# Altium project Quail_3.0.PrjPcb (part 1 of 3)
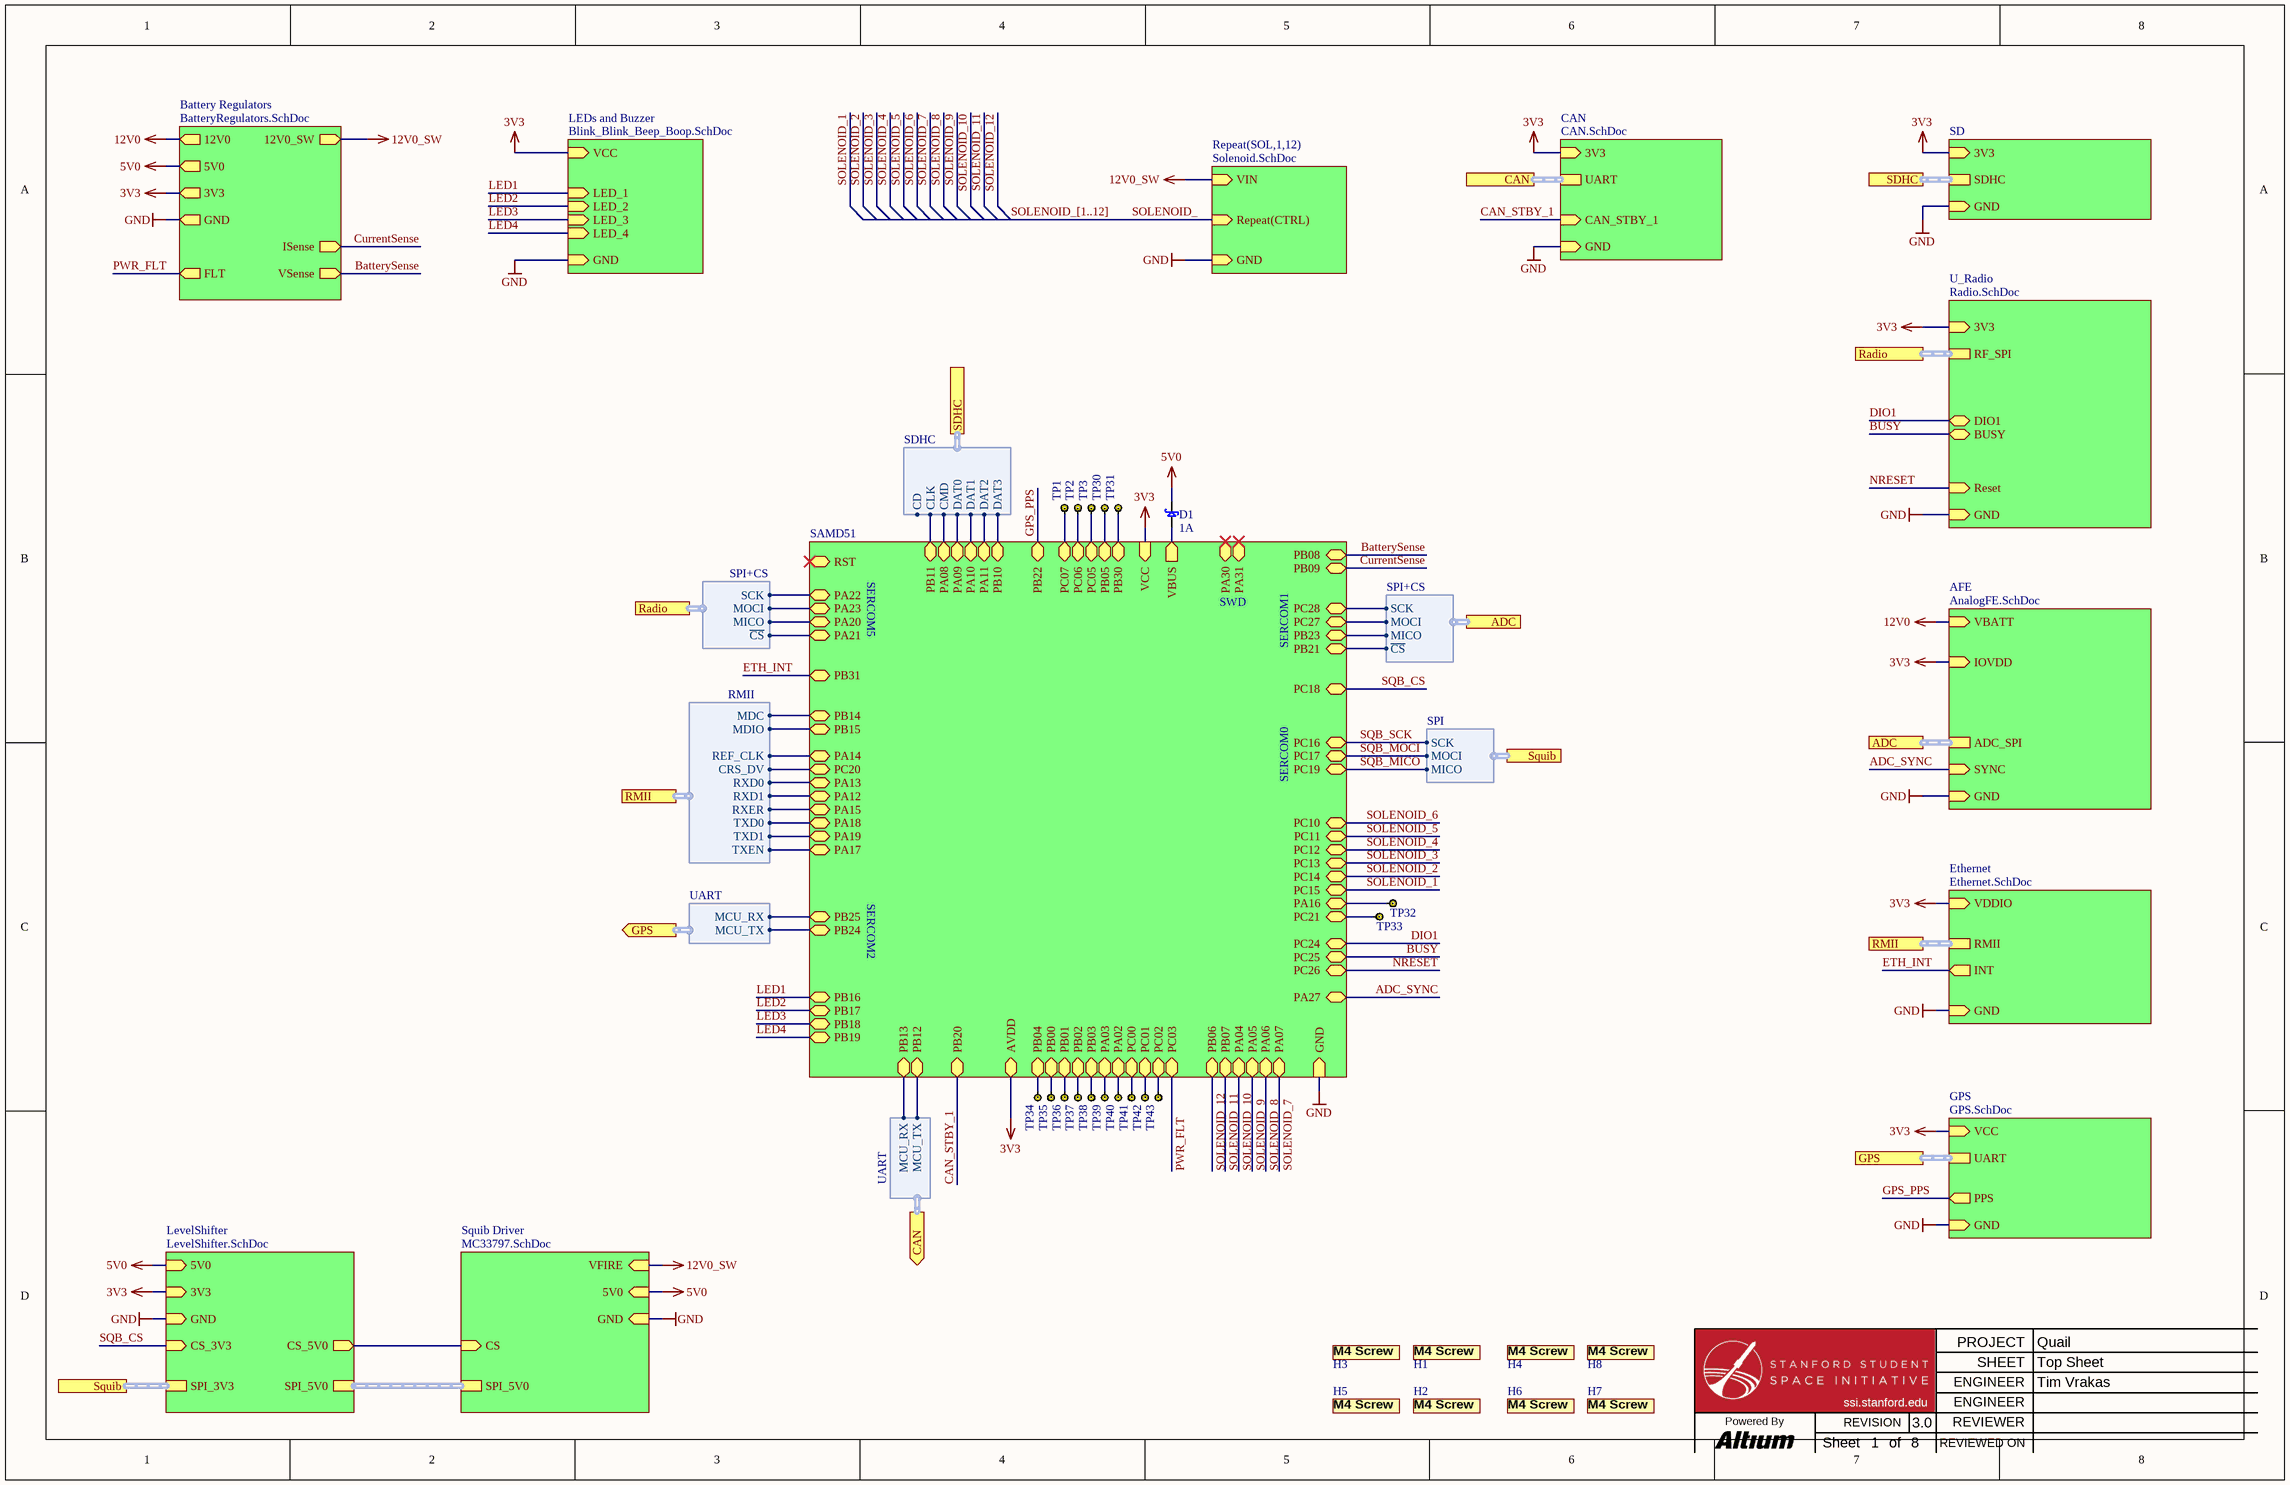
[diagram p0: Quail.SchDoc]
prjEngineer1: Tim Vrakas; prjRevision: 3.0; prjTitle: Quail
16 sheets, 428 parts. Net scope: strictly hierarchical (ports join the sheet entries above them; power ports are local).
Board file: Quail.PcbDoc
Sheets:
  Quail.SchDoc
    Battery Regulators = BatteryRegulators.SchDoc
    Squib Driver = MC33797.SchDoc
    LevelShifter = LevelShifter.SchDoc
    LEDs and Buzzer = Blink_Blink_Beep_Boop.SchDoc
    SAMD51 = SAMD51.SchDoc
    SD = SD.SchDoc
    U_Radio = Radio.SchDoc
    AFE = AnalogFE.SchDoc
      LC1 = LoadCell.SchDoc
      PT1 = PressureTransducer.SchDoc
      TC1 = Thermocouple.SchDoc
      TC2 = Thermocouple.SchDoc
      TC3 = Thermocouple.SchDoc
      LC2 = LoadCell.SchDoc
      PT2 = PressureTransducer.SchDoc
      PT3 = PressureTransducer.SchDoc
      PT4 = PressureTransducer.SchDoc
    Ethernet = Ethernet.SchDoc
    GPS = GPS.SchDoc
    CAN = CAN.SchDoc
    SOL1 = Solenoid.SchDoc
    SOL2 = Solenoid.SchDoc
    SOL3 = Solenoid.SchDoc
    SOL4 = Solenoid.SchDoc
    SOL5 = Solenoid.SchDoc
    SOL6 = Solenoid.SchDoc
    SOL7 = Solenoid.SchDoc
    SOL8 = Solenoid.SchDoc
    SOL9 = Solenoid.SchDoc
    SOL10 = Solenoid.SchDoc
    SOL11 = Solenoid.SchDoc
    SOL12 = Solenoid.SchDoc

## Sheet Quail.SchDoc: Top Sheet
size Tabloid; DocumentNumber: 1; SheetNumber: 1; SheetTotal: 8; Project: Olympus

### Parts
D1  Current - Average Rectified (Io): 1A  [SMA]  (hidden comment: Diode_CD214A-B1100LF)
H1  SCREW_M4_PAN_PHILLIPS  [SCREW_M4]  (value not drawn)
H2  SCREW_M4_PAN_PHILLIPS  [SCREW_M4]  (value not drawn)
H3  SCREW_M4_PAN_PHILLIPS  [SCREW_M4]  (value not drawn)
H4  SCREW_M4_PAN_PHILLIPS  [SCREW_M4]  (value not drawn)
H5  SCREW_M4_PAN_PHILLIPS  [SCREW_M4]  (value not drawn)
H6  SCREW_M4_PAN_PHILLIPS  [SCREW_M4]  (value not drawn)
H7  SCREW_M4_PAN_PHILLIPS  [SCREW_M4]  (value not drawn)
H8  SCREW_M4_PAN_PHILLIPS  [SCREW_M4]  (value not drawn)
TP1  TEST_POINT_BLACK_KEYSTONE_5001  [TEST_POINT_BLACK_KEYSTONE_5001-Footprint-1]  (value not drawn)
TP2  TEST_POINT_BLACK_KEYSTONE_5001  [TEST_POINT_BLACK_KEYSTONE_5001-Footprint-1]  (value not drawn)
TP3  TEST_POINT_BLACK_KEYSTONE_5001  [TEST_POINT_BLACK_KEYSTONE_5001-Footprint-1]  (value not drawn)
TP30  TEST_POINT_BLACK_KEYSTONE_5001  [TEST_POINT_BLACK_KEYSTONE_5001-Footprint-1]  (value not drawn)
TP31  TEST_POINT_BLACK_KEYSTONE_5001  [TEST_POINT_BLACK_KEYSTONE_5001-Footprint-1]  (value not drawn)
TP32  TEST_POINT_BLACK_KEYSTONE_5001  [TEST_POINT_BLACK_KEYSTONE_5001-Footprint-1]  (value not drawn)
TP33  TEST_POINT_BLACK_KEYSTONE_5001  [TEST_POINT_BLACK_KEYSTONE_5001-Footprint-1]  (value not drawn)
TP34  TEST_POINT_BLACK_KEYSTONE_5001  [TEST_POINT_BLACK_KEYSTONE_5001-Footprint-1]  (value not drawn)
TP35  TEST_POINT_BLACK_KEYSTONE_5001  [TEST_POINT_BLACK_KEYSTONE_5001-Footprint-1]  (value not drawn)
TP36  TEST_POINT_BLACK_KEYSTONE_5001  [TEST_POINT_BLACK_KEYSTONE_5001-Footprint-1]  (value not drawn)
TP37  TEST_POINT_BLACK_KEYSTONE_5001  [TEST_POINT_BLACK_KEYSTONE_5001-Footprint-1]  (value not drawn)
TP38  TEST_POINT_BLACK_KEYSTONE_5001  [TEST_POINT_BLACK_KEYSTONE_5001-Footprint-1]  (value not drawn)
TP39  TEST_POINT_BLACK_KEYSTONE_5001  [TEST_POINT_BLACK_KEYSTONE_5001-Footprint-1]  (value not drawn)
TP40  TEST_POINT_BLACK_KEYSTONE_5001  [TEST_POINT_BLACK_KEYSTONE_5001-Footprint-1]  (value not drawn)
TP41  TEST_POINT_BLACK_KEYSTONE_5001  [TEST_POINT_BLACK_KEYSTONE_5001-Footprint-1]  (value not drawn)
TP42  TEST_POINT_BLACK_KEYSTONE_5001  [TEST_POINT_BLACK_KEYSTONE_5001-Footprint-1]  (value not drawn)
TP43  TEST_POINT_BLACK_KEYSTONE_5001  [TEST_POINT_BLACK_KEYSTONE_5001-Footprint-1]  (value not drawn)

### Sub-sheets
AFE = AnalogFE.SchDoc: VBATT (in), ADC_SPI (harness SPI+CS), GND (in), SYNC (in), IOVDD (in)
Battery Regulators = BatteryRegulators.SchDoc: 5V0 (out), 12V0 (out), 3V3 (out), GND (out), ISense (out), VSense (out), 12V0_SW (out), FLT (out)
CAN = CAN.SchDoc: 3V3 (in), GND (in), UART (harness UART), CAN_STBY_1 (in)
Ethernet = Ethernet.SchDoc: VDDIO (in), RMII (harness RMII), GND (in), INT (out)
GPS = GPS.SchDoc: VCC (in), GND (in), UART (harness UART), PPS (out)
LEDs and Buzzer = Blink_Blink_Beep_Boop.SchDoc: LED_4 (in), LED_2 (in), LED_1 (in), VCC (in), LED_3 (in), GND (in)
LevelShifter = LevelShifter.SchDoc: SPI_3V3 (harness SPI), SPI_5V0 (harness SPI), 3V3 (in), 5V0 (in), CS_5V0 (out), CS_3V3 (in), GND (in)
Repeat(SOL,1,12) = Solenoid.SchDoc: GND (in), VIN (in), Repeat(CTRL) (in)
SAMD51 = SAMD51.SchDoc: PA12 (bidir), PA13 (bidir), PA05 (bidir), PA07 (bidir), PA04 (bidir), PA06 (bidir), PB11 (bidir), PA08 (bidir), PA09 (bidir), PA10 (bidir), PA11 (bidir), PB10 (bidir), PB12 (bidir), PB13 (bidir), PA22 (bidir), PA23 (bidir), PA19 (bidir), PA17 (bidir), PA20 (bidir), PA21 (bidir), PB08 (bidir), PB07 (bidir), PB06 (bidir), PB09 (bidir), PB04 (bidir), PA03 (bidir), PA02 (bidir), PB05 (bidir), PB00 (bidir), PB30 (bidir), PA31 (bidir), PA30 (bidir), PB31 (bidir), PB16 (bidir), PA14 (bidir), PB17 (bidir), PB23 (bidir), PB22 (bidir), PA27 (bidir), PB02 (bidir), PB01 (bidir), PB03 (bidir), PA18 (bidir), GND (in), VCC (in), VBUS (out), PB14 (bidir), PB15 (bidir), PA15 (bidir), RST (bidir), PA16 (bidir), AVDD (bidir), PB21 (bidir), PC02 (bidir), PB20 (bidir), PB24 (bidir), PB18 (bidir), PB19 (bidir), PC10 (bidir), PC00 (bidir), PC07 (bidir), PC05 (bidir), PB25 (bidir), PC01 (bidir), PC06 (bidir), PC03 (bidir), PC14 (bidir), PC20 (bidir), PC15 (bidir), PC21 (bidir), PC26 (bidir), PC28 (bidir), PC25 (bidir), PC18 (bidir), PC19 (bidir), PC13 (bidir), PC24 (bidir), PC16 (bidir), PC12 (bidir), PC27 (bidir), PC17 (bidir), PC11 (bidir)
SD = SD.SchDoc: SDHC (harness SDHC), GND (in), 3V3 (in)
Squib Driver = MC33797.SchDoc: VFIRE (in), SPI_5V0 (harness SPI), CS (in), GND (in), 5V0 (in)
U_Radio = Radio.SchDoc: DIO1 (bidir), Reset (in), RF_SPI (harness SPI+CS), 3V3 (in), GND (in), BUSY (bidir)

### Ports
ADC (harness SPI+CS), CAN (harness UART), CAN (out, harness UART), GPS (harness UART), GPS (out, harness UART), Radio (harness SPI+CS), RMII (harness RMII), SDHC (harness SDHC), Squib (harness SPI)

### Harnesses
SDHC: CD, CLK, CMD, DAT0, DAT1, DAT2, DAT3
SPI+CS: SCK, MOCI, MICO, ~{CS}
SPI: SCK, MOCI, MICO
RMII: MDC, MDIO, REF_CLK, CRS_DV, RXD0, RXD1, RXER, TXD0, TXD1, TXEN
UART: MCU_RX, MCU_TX

### Nets
3V3: sheet Battery Regulators/3V3, sheet LevelShifter/3V3, sheet LEDs and Buzzer/VCC, sheet SAMD51/VCC, sheet SAMD51/AVDD, sheet SD/3V3, sheet U_Radio/3V3, sheet AFE/IOVDD, sheet Ethernet/VDDIO, sheet GPS/VCC, sheet CAN/3V3  [project net IOVDD]
5V0: D1.2(Cathode) ; sheet Battery Regulators/5V0, sheet Squib Driver/5V0, sheet LevelShifter/5V0
12V0: sheet Battery Regulators/12V0, sheet AFE/VBATT
12V0_SW: sheet Battery Regulators/12V0_SW, sheet Squib Driver/VFIRE, sheet Repeat(SOL,1,12)/VIN
GND: sheet Battery Regulators/GND, sheet Squib Driver/GND, sheet LevelShifter/GND, sheet LEDs and Buzzer/GND, sheet SAMD51/GND, sheet SD/GND, sheet U_Radio/GND, sheet AFE/GND, sheet Ethernet/GND, sheet GPS/GND, sheet CAN/GND, sheet Repeat(SOL,1,12)/GND  [project net DGND]
VBUS: D1.1(Anode) ; sheet SAMD51/VBUS
ADC_CS: sheet SAMD51/PB21, port ADC.~{CS}
ADC_MICO: sheet SAMD51/PB23, port ADC.MICO
ADC_MOCI: sheet SAMD51/PC27, port ADC.MOCI
ADC_SCK: sheet SAMD51/PC28, port ADC.SCK
ADC_SYNC: sheet SAMD51/PA27, sheet AFE/SYNC
BatterySense: sheet Battery Regulators/VSense, sheet SAMD51/PB08
BUSY: sheet SAMD51/PC25, sheet U_Radio/BUSY
CAN_STBY_1: sheet SAMD51/PB20, sheet CAN/CAN_STBY_1
CurrentSense: sheet Battery Regulators/ISense, sheet SAMD51/PB09
DIO1: sheet SAMD51/PC24, sheet U_Radio/DIO1
ETH_CRS_DV: sheet SAMD51/PC20, port RMII.CRS_DV
ETH_INT: sheet SAMD51/PB31, sheet Ethernet/INT
ETH_MDC: sheet SAMD51/PB14, port RMII.MDC
ETH_MDIO: sheet SAMD51/PB15, port RMII.MDIO
ETH_REF_CLK: sheet SAMD51/PA14, port RMII.REF_CLK
ETH_RXD0: sheet SAMD51/PA13, port RMII.RXD0
ETH_RXD1: sheet SAMD51/PA12, port RMII.RXD1
ETH_RXER: sheet SAMD51/PA15, port RMII.RXER
ETH_TXD0: sheet SAMD51/PA18, port RMII.TXD0
ETH_TXD1: sheet SAMD51/PA19, port RMII.TXD1
ETH_TXEN: sheet SAMD51/PA17, port RMII.TXEN
GPS_PPS: sheet SAMD51/PB22, sheet GPS/PPS
GPS_RX: sheet SAMD51/PB24, port GPS.MCU_TX
GPS_TX: sheet SAMD51/PB25, port GPS.MCU_RX
LED1: sheet LEDs and Buzzer/LED_1, sheet SAMD51/PB16
LED2: sheet LEDs and Buzzer/LED_2, sheet SAMD51/PB17
LED3: sheet LEDs and Buzzer/LED_3, sheet SAMD51/PB18
LED4: sheet LEDs and Buzzer/LED_4, sheet SAMD51/PB19
NRESET: sheet SAMD51/PC26, sheet U_Radio/Reset
PWR_FLT: sheet Battery Regulators/FLT, sheet SAMD51/PC03
SD_CLK: sheet SAMD51/PB11, port SDHC.CLK
SD_CMD: sheet SAMD51/PA08, port SDHC.CMD
SD_DAT0: sheet SAMD51/PA09, port SDHC.DAT0
SD_DAT1: sheet SAMD51/PA10, port SDHC.DAT1
SD_DAT2: sheet SAMD51/PA11, port SDHC.DAT2
SD_DAT3: sheet SAMD51/PB10, port SDHC.DAT3
SOLENOID_: sheet Repeat(SOL,1,12)/Repeat(CTRL)
SQB_CS: sheet LevelShifter/CS_3V3, sheet SAMD51/PC18
SQB_MICO: sheet SAMD51/PC19, port Squib.MICO
SQB_MOCI: sheet SAMD51/PC17, port Squib.MOCI
SQB_SCK: sheet SAMD51/PC16, port Squib.SCK
SQUIB_CS: sheet Squib Driver/CS, sheet LevelShifter/CS_5V0
NetCANA1_1: sheet SAMD51/PB13, port CAN.MCU_RX
NetCANA1_4: sheet SAMD51/PB12, port CAN.MCU_TX
NetTP1_1: TP1.1 ; sheet SAMD51/PC07
NetTP2_1: TP2.1 ; sheet SAMD51/PC06
NetTP3_1: TP3.1 ; sheet SAMD51/PC05
NetTP30_1: TP30.1 ; sheet SAMD51/PB05
NetTP31_1: TP31.1 ; sheet SAMD51/PB30
NetTP32_1: TP32.1 ; sheet SAMD51/PA16
NetTP33_1: TP33.1 ; sheet SAMD51/PC21
NetTP34_1: TP34.1 ; sheet SAMD51/PB04
NetTP35_1: TP35.1 ; sheet SAMD51/PB00
NetTP36_1: TP36.1 ; sheet SAMD51/PB01
NetTP37_1: TP37.1 ; sheet SAMD51/PB02
NetTP38_1: TP38.1 ; sheet SAMD51/PB03
NetTP39_1: TP39.1 ; sheet SAMD51/PA03
NetTP40_1: TP40.1 ; sheet SAMD51/PA02
NetTP41_1: TP41.1 ; sheet SAMD51/PC00
NetTP42_1: TP42.1 ; sheet SAMD51/PC01
NetTP43_1: TP43.1 ; sheet SAMD51/PC02
NetU9_70: sheet SAMD51/PA20, port Radio.MICO
NetU9_71: sheet SAMD51/PA21, port Radio.~{CS}
NetU9_72: sheet SAMD51/PA22, port Radio.SCK
NetU9_73: sheet SAMD51/PA23, port Radio.MOCI

### Buses and harness runs
bus SOLENOID_[1..12]
harness port ADC = sheet AFE/ADC_SPI
harness port CAN = sheet CAN/UART
harness port GPS = sheet GPS/UART
harness port Radio = sheet U_Radio/RF_SPI
harness port RMII = sheet Ethernet/RMII
harness port SDHC = sheet SD/SDHC
harness port Squib = sheet LevelShifter/SPI_3V3
harness sheet LevelShifter/SPI_5V0 = sheet Squib Driver/SPI_5V0

### Notes on the sheet
- SERCOM5
- SWD
- SERCOM1
- SERCOM0
- SERCOM2
- PROJECT
- SHEET
- Powered By
- Sheet
- of
- REVISION
- ssi.stanford.edu
- ENGINEER
- REVIEWER
- REVIEWED ON
- (in symbol CMP-054-0009-1) M4 Screw

### Library data of the parts
D1 = CMP-033-0060-1: Diode Schottky 100V 1A Surface Mount SMA (DO-214AC); Manufacturer: Bourns Inc.; Voltage - Forward (Vf) (Max) @ If: 790mV @ 1A; Current - Reverse Leakage @ Vr: 500µA @ 100V; Speed: Fast Recovery =< 500ns, > 200mA (Io); Capacitance @ Vr, F: 30pF @ 4V, 1MHz; Design Item ID: Diode_CD214A-B1100LF; Part Status: Active; Source: diode.SchLib; Stock 1: 21982; Manufacturer Part Number: CD214A-B1100LF; Diode Type: Schottky; Voltage - DC Reverse (Vr) (Max): 100V; Reverse Recovery Time (trr): -; Operating Temperature - Junction: -55°C ~ 125°C; RoHS: RoHS Compliant; Supplier Device Package: SMA (DO-214AC); Package / Case: DO-214AC, SMA; Packaging: Cut Tape (CT); ComponentLink1Description: http://www.bourns.com/docs/Product-Datasheets/CD214-B120_B1100.pdf; Mounting Type: Surface Mount; Pricing 1: 1=0.54, 10=0.42, 25=0.3544, 100=0.2888, 250=0.2392, 500=0.1976, 1000=0.148, 2500=0.136 (USD); ComponentLink1URL: http://www.bourns.com/docs/Product-Datasheets/CD214-B120_B1100.pdf
H1-H8 = CMP-054-0009-1: MACHINE SCREW PAN PHILLIPS M4; Manufacturer: B&F Fastener Supply; Manufacturer Part Number: MPMS 004 0008 PH; Head Diameter: 0.308" (7.82mm); Screw Head Type: Pan Head; Head Height: 0.120" (3.05mm); Plating: Zinc; Length - Below Head: 0.315" (8.00mm); Features: -; Length - Overall: 0.435" (11.05mm); ComponentLink1Description: Datasheet; Source: mechanical.SchLib; ComponentLink1URL: http://www.fasnetdirect.com/refguide/MetD7985a.pdf; Drive Type: Phillips; Material: -; Thread Size: M4; Pricing 1: 100=0.0756, 1000=0.06048 (USD); Design Item ID: SCREW_M4_PAN_PHILLIPS; RoHS: RoHS non-compliant; Stock 1: 2800
TP1-TP3 TP30-TP43 = CMP-055-0004-2: BLACK T/H TEST POINT; Manufacturer Part Number: 5001; Manufacturer: Keystone Electronics; Material - Body: Phosphor Bronze; Plating: Silver; Material - Insulation: Nylon 46, UL 94V-0; Design Item ID: TEST_POINT_BLACK_KEYSTONE_5001; Color: Black; Packaging: Bulk; Stock 1: 718799; Pricing 1: 1=0.37, 10=0.316, 50=0.2298, 100=0.2209, 250=0.19832, 500=0.18932, 1000=0.1616, 2500=0.14424, 5000=0.13523 (USD); ComponentLink1URL: http://www.keyelco.com/product-pdf.cfm?p=1310; RoHS: RoHS Compliant; Part Status: Active; Size / Dimension: 0.100" Dia x 0.180" L (2.54mm x 4.57mm); Source: mechanical.SchLib; ComponentLink1Description: http://www.keyelco.com/product-pdf.cfm?p=1310; Mounting Type: 0.040" (1.02mm) Hole Diameter

## Sheet BatteryRegulators.SchDoc: Power Regulation
size Legal; DocumentNumber: 3; SheetNumber: 3; SheetTotal: 8; Project: Olympus
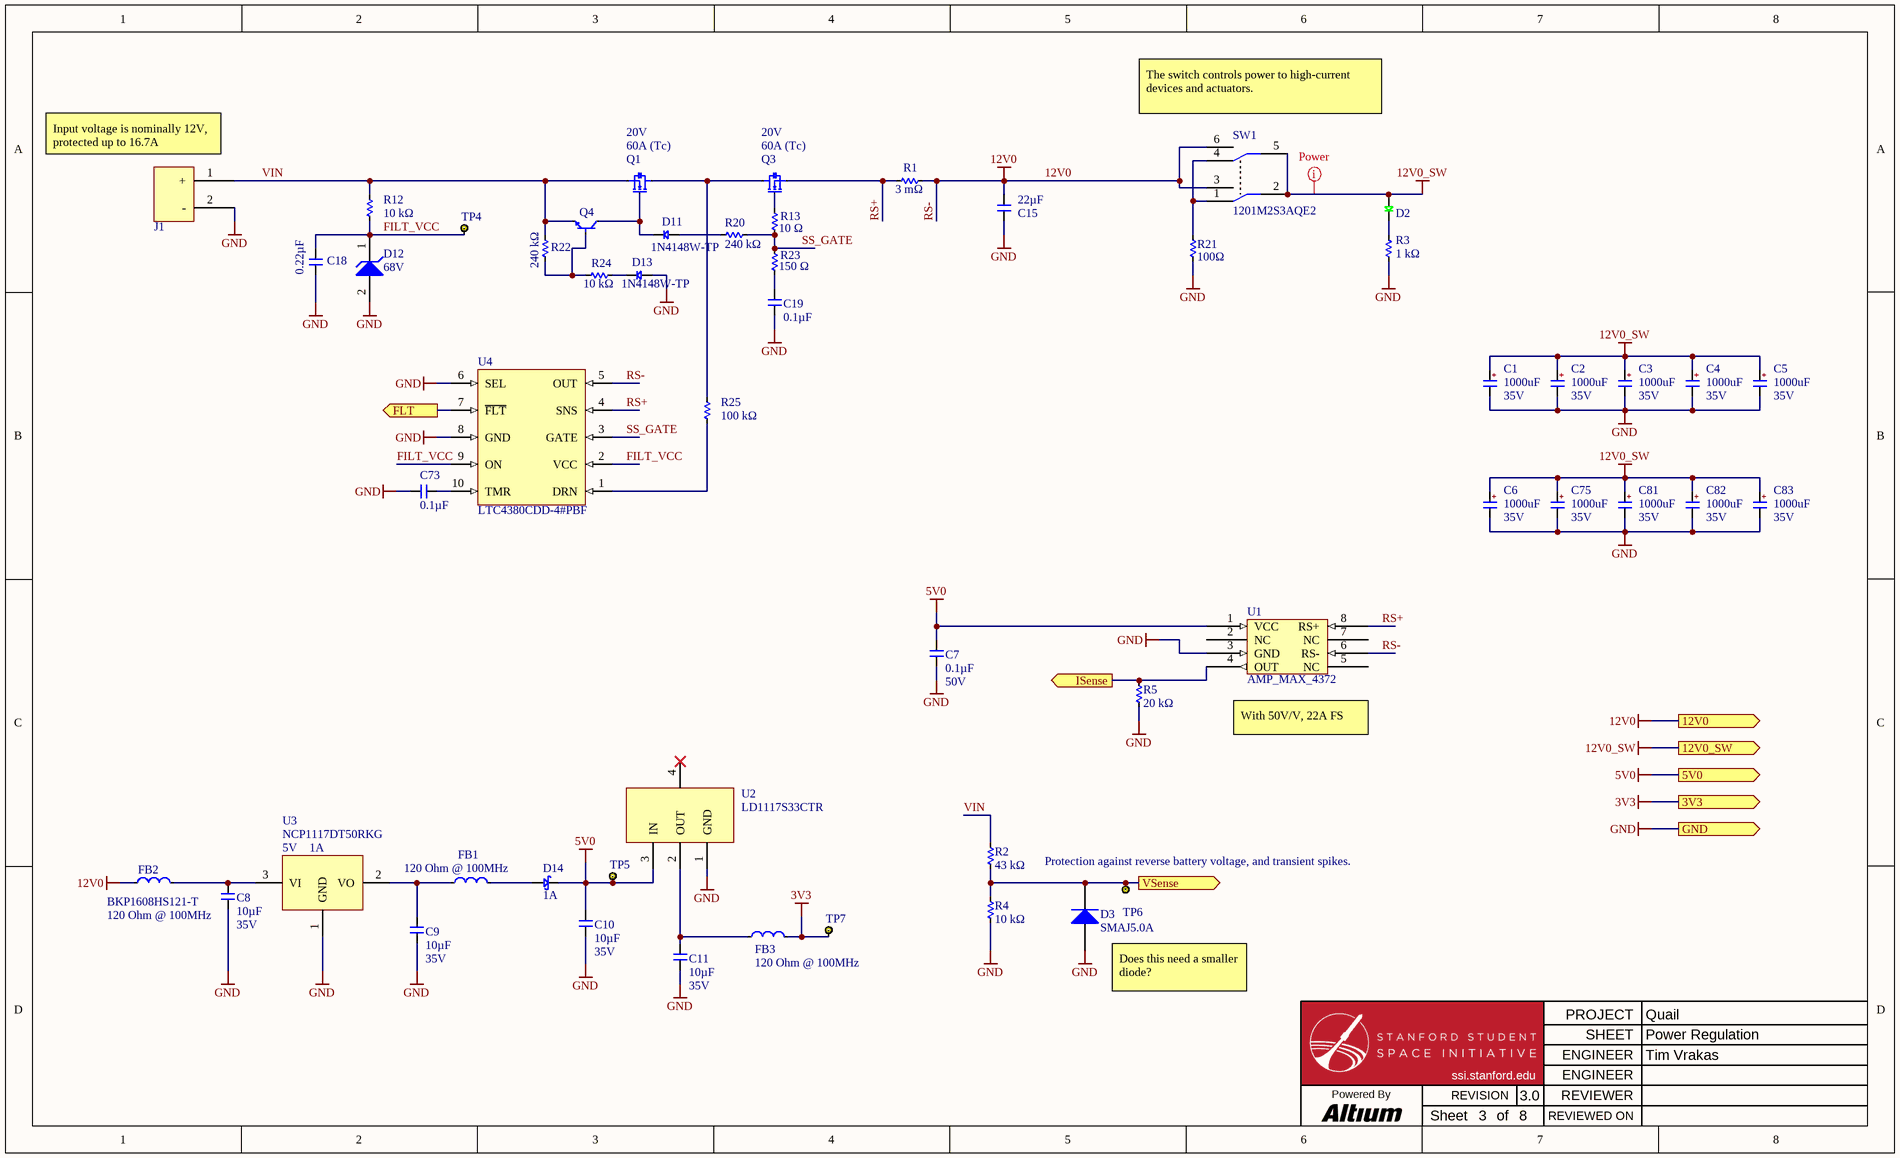
[diagram p1: BatteryRegulators.SchDoc]

### Parts
C1  value 1000uF  Rating: 35V  [ALUM_CAP_5mm-Leads]  (hidden comment: CAP_ALUM_1000uF_ECA-1VM102B)
C2  value 1000uF  Rating: 35V  [ALUM_CAP_5mm-Leads]  (hidden comment: CAP_ALUM_1000uF_ECA-1VM102B)
C3  value 1000uF  Rating: 35V  [ALUM_CAP_5mm-Leads]  (hidden comment: CAP_ALUM_1000uF_ECA-1VM102B)
C4  value 1000uF  Rating: 35V  [ALUM_CAP_5mm-Leads]  (hidden comment: CAP_ALUM_1000uF_ECA-1VM102B)
C5  value 1000uF  Rating: 35V  [ALUM_CAP_5mm-Leads]  (hidden comment: CAP_ALUM_1000uF_ECA-1VM102B)
C6  value 1000uF  Rating: 35V  [ALUM_CAP_5mm-Leads]  (hidden comment: CAP_ALUM_1000uF_ECA-1VM102B)
C7  Capacitance (shorthand): 0.1µF  Rated Voltage: 50V  [C0603]  (hidden comment: 490-1519-1-ND)
C8  Capacitance (shorthand): 10µF  Rated Voltage: 35V  [C0603]  (hidden comment: 490-13248-1-ND)
C9  Capacitance (shorthand): 10µF  Rated Voltage: 35V  [C0603]  (hidden comment: 490-13248-1-ND)
C10  Capacitance (shorthand): 10µF  Rated Voltage: 35V  [C0603]  (hidden comment: 490-13248-1-ND)
C11  Capacitance (shorthand): 10µF  Rated Voltage: 35V  [C0603]  (hidden comment: 490-13248-1-ND)
C15  Capacitance (shorthand): 22µF  [C0603]  (hidden comment: 1276-7076-1-ND)
C18  Capacitance (shorthand): 0.22µF  [C0603]  (hidden comment: 490-12546-1-ND)
C19  Capacitance (shorthand): 0.1µF  [C0603]  (hidden comment: 490-1519-1-ND)
C73  Capacitance (shorthand): 0.1µF  [C0603]  (hidden comment: 490-1519-1-ND)
C75  value 1000uF  Rating: 35V  [ALUM_CAP_5mm-Leads]  (hidden comment: CAP_ALUM_1000uF_ECA-1VM102B)
C81  value 1000uF  Rating: 35V  [ALUM_CAP_5mm-Leads]  (hidden comment: CAP_ALUM_1000uF_ECA-1VM102B)
C82  value 1000uF  Rating: 35V  [ALUM_CAP_5mm-Leads]  (hidden comment: CAP_ALUM_1000uF_ECA-1VM102B)
C83  value 1000uF  Rating: 35V  [ALUM_CAP_5mm-Leads]  (hidden comment: CAP_ALUM_1000uF_ECA-1VM102B)
D2  LED_C503B-GCS-CB0C0781  [LED_TH_5MM]  (value not drawn)
D3  SMAJ5.0A  [BOUR-SMA-2_V]
D11  Manufacturer Part Number: 1N4148W-TP  [SOD123]  (hidden comment: DIODE_1N4148WTPMSTR)
D12  Zener Voltage: 68V  [ONSC-SOD-123-2-425-04_V]  (hidden comment: MMSZ5266BT1G)
D13  Manufacturer Part Number: 1N4148W-TP  [SOD123]  (hidden comment: DIODE_1N4148WTPMSTR)
D14  Current - Average Rectified (Io): 1A  [SMA]  (hidden comment: Diode_CD214A-B1100LF)
FB1  Impedance @ Frequency: 120 Ohm @ 100MHz  [C0603]  (hidden comment: FB_120@100MHz_0603)
FB2  Manufacturer Part Number: BKP1608HS121-T  Impedance @ Frequency: 120 Ohm @ 100MHz  [C0603]  (hidden comment: FB_120@100MHz_0603)
FB3  Impedance @ Frequency: 120 Ohm @ 100MHz  [C0603]  (hidden comment: FB_120@100MHz_0603)
J1  XT60PW-M  [XT60PW-M-Footprint-1]  (value not drawn)
Q1  Drain to Source Voltage (Vdss): 20V  Current - Continuous Drain (Id) @ 25°C: 60A (Tc)  [POWERPAK_SO-8_SINGLE]  (hidden comment: NFET_SIR404DP-T1-GE3CT-ND)
Q3  Drain to Source Voltage (Vdss): 20V  Current - Continuous Drain (Id) @ 25°C: 60A (Tc)  [POWERPAK_SO-8_SINGLE]  (hidden comment: NFET_SIR404DP-T1-GE3CT-ND)
Q4  NPN_MMBT3904-7-F  [3SOT23]  (value not drawn)
R1  Resistance (Ohms): 3 mΩ  [R2512]  (hidden comment: TLRP3A20CR003FTDG)
R2  Resistance: 43 kΩ  [R0603]  (hidden comment: 311-43.0KHRCT-ND)
R3  Resistance: 1 kΩ  [R0603]  (hidden comment: 311-1.00KHRCT-ND)
R4  Resistance: 10 kΩ  [R0603]  (hidden comment: 311-10.0KHRCT-ND)
R5  Resistance: 20 kΩ  [R0603]  (hidden comment: 311-20.0KHRCT-ND)
R12  Resistance: 10 kΩ  [R0603]  (hidden comment: 311-10.0KHRCT-ND)
R13  Resistance: 10 Ω  [R0603]  (hidden comment: 311-10.0HRCT-ND)
R20  Resistance: 240 kΩ  [R0603]  (hidden comment: 311-240KHRCT-ND)
R21  Resistance: 100Ω  [R2512]  (hidden comment: RC2512JK-7W100RL)
R22  Resistance: 240 kΩ  [R0603]  (hidden comment: 311-240KHRCT-ND)
R23  Resistance: 150 Ω  [R0603]  (hidden comment: 311-150HRCT-ND)
R24  Resistance: 10 kΩ  [R0603]  (hidden comment: 311-10.0KHRCT-ND)
R25  Resistance: 100 kΩ  [R0603]  (hidden comment: 311-100KHRCT-ND)
SW1  1201M2S3AQE2  [1201M2S3AQE2-Footprint-1]
TP4  TEST_POINT_BLACK_KEYSTONE_5001  [TEST_POINT_BLACK_KEYSTONE_5001-Footprint-1]  (value not drawn)
TP5  TEST_POINT_BLACK_KEYSTONE_5001  [TEST_POINT_KEYSTONE_5001]  (value not drawn)
TP6  TEST_POINT_BLACK_KEYSTONE_5001  [TEST_POINT_BLACK_KEYSTONE_5001-Footprint-1]  (value not drawn)
TP7  TEST_POINT_BLACK_KEYSTONE_5001  [TEST_POINT_KEYSTONE_5001]  (value not drawn)
U1  AMP_MAX_4372  [8SOIC150]
U2  Manufacturer Part Number: LD1117S33CTR  [4SOT223]  (hidden comment: LDO_LD1117S33CTR)
U3  Manufacturer Part Number: NCP1117DT50RKG  Voltage - Output: 5V  Current - Output: 1A  [DPAK]  (hidden comment: LDO_NCP1117DT50RKG)
U4  LTC4380CDD-4#PBF  [SON50P300X75_HS-11N]

### Ports
3V3 (out), 5V0 (out), 12V0 (out), 12V0_SW (out), FLT (out), GND (out), ISense (out), VSense (out)

### Nets
3V3: FB3.2 TP7.1 ; port 3V3  [project net IOVDD]
5V0: C7.1 C10.1 D14.2(Cathode) TP5.1 U1.1(VCC) U2.3(IN) ; port 5V0
12V0: C15.1 FB2.1 R1.2 SW1.3 SW1.6 U1.6(RS-) U4.5(OUT) ; port 12V0  [also labelled RS-]
12V0_SW: C1.1(A) C2.1(A) C3.1(A) C4.1(A) C5.1(A) C6.1(A) C75.1(A) C81.1(A) C82.1(A) C83.1(A) D2.1(A) SW1.2 SW1.5 ; port 12V0_SW
GND: C1.2(C) C2.2(C) C3.2(C) C4.2(C) C5.2(C) C6.2(C) C7.2 C8.2 C9.2 C10.2 C11.2 C15.2 C18.2 C19.2 C73.1 C75.2(C) C81.2(C) C82.2(C) C83.2(C) D3.1(A) D12.2(A) D13.1 J1.2(-) R3.1 R4.1 R5.1 R21.1 U1.3(GND) U2.1(GND) U3.1(GND) U4.6(SEL) U4.8(GND) ; port GND  [project net DGND]
BatterySense: D3.2(K) R2.1 R4.2 TP6.1 ; port VSense
CurrentSense: R5.2 U1.4(OUT) ; port ISense
FILT_VCC: C18.1 D12.1(K) R12.1 TP4.1 U4.2(VCC) U4.9(ON)
PWR_FLT: U4.7(~{FLT}) ; port FLT
RS+: Q3.3(S) R1.1 U1.8(RS+) U4.4(SNS)
SS_GATE: R13.1 R20.2 R23.2 U4.3(GATE)
VIN: J1.1(+) Q1.3(S) Q4.3(E) R2.2 R12.2 R22.2
NetC8_1: C8.1 FB2.2 U3.3(VI)
NetC9_1: C9.1 FB1.1 U3.2(VO)
NetC11_1: C11.1 FB3.1 U2.2(OUT)
NetC19_1: C19.1 R23.1
NetC73_2: C73.2 U4.10(TMR)
NetD2_2: D2.2(K) R3.2
NetD11_1: D11.1 R20.1
NetD11_2: D11.2 Q1.2(G) Q4.2(C)
NetD13_2: D13.2 R24.1
NetD14_1: D14.1(Anode) FB1.2
NetQ1_1: Q1.1(D) Q3.1(D) R25.2
NetQ3_2: Q3.2(G) R13.2
NetQ4_1: Q4.1(B) R22.1 R24.2
NetR21_2: R21.2 SW1.1 SW1.4
NetR25_1: R25.1 U4.1(DRN)

Not connected (* = marked no-connect by the designer): U1 2(NC) 5(NC) 7(NC); U2 4(GND)*

### Layout directives
mark named Power: 12V0_SW

### Notes on the sheet
- (near J1) Input voltage is nominally 12V, protected up to 16.7A
- (near SW1) The switch controls power to high-current devices and actuators.
- (near U1) With 50V/V, 22A FS
- (near TP6) Protection against reverse battery voltage, and transient spikes.
- Does this need a smaller diode?
- PROJECT
- SHEET
- Powered By
- Sheet
- of
- REVISION
- ssi.stanford.edu
- ENGINEER
- REVIEWER
- REVIEWED ON
- (in symbol CMP-026-0007-2) +

### Library data of the parts
C1-C6 C75 C81-C83 = CMP-026-0007-2: 1000uF (1mF) Electrolytic Capacitor in a 12.5mm x 20mm can package; Rule: UNIONINDEX=0|RULEKIND=PolygonConnect|NETSCOPE=AnyNet|LAYERKIND=SameLayer|NAME=Schematic Polygon Connect Style|CONNECTSTYLE=Direct|RELIEFCONDUCTORWIDTH=10mil|RELIEFENTRIES=4|POLYGONRELIEFANGLE=45 Angle|AIRGAPWIDTH=10mil|UNIT=Imperial; Design Item ID: CAP_ALUM_1000uF_ECA-1VM102B
C7 C19 C73 = CMP-119-0065-1: CAP CER 0603 0.1µF X7R 50V 10%; Manufacturer: Murata Electronics North America; Capacitance - pF (Machine readable): #NAME?; Dielectric: X7R
  C19 C73: Rated Voltage: 50V
C8-C11 = CMP-119-0071-1: CAP CER 10UF 35V X5R 0603 20%; Manufacturer: Murata Electronics North America; Capacitance - pF (Machine readable): #NAME?; Dielectric: X5R
C15 = CMP-119-0072-1: CAP CER 22UF 16V X5R 0603 20%; Manufacturer: Samsung Electro-Mechanics; Capacitance - pF (Machine readable): #NAME?; Rated Voltage: 16V; Dielectric: X5R
C18 = CMP-119-0067-1: CAP CER 0603 0.22µF X7R 50V 10%; Manufacturer: Murata Electronics North America; Capacitance - pF (Machine readable): #NAME?; Rated Voltage: 50V; Dielectric: X7R
D2 = CMP-033-0070-3: LED GREEN CLEAR 5MM ROUND T/H; Manufacturer: Cree; Lens Colour: Colorless; Luminous Intensity: 24850mcd; Viewing Angle: 30°; Forward Current: 20mA; Forward Voltage: 3.2V; Lens Style: Dome; Dominant Wavelength: 527nm; Power Rating: 120mW; Reverse Voltage (DC): 5V; Number of LEDs: 1; Manufacturer Part Number: C503B-GCS-CB0C0781; Stock 1: 191; Pricing 1: 1=0.25, 10=0.236, 100=0.2184, 1000=0.1954, 50000=0.1814 (USD); Mount: Through Hole; Case/Package: Radial; Colour: Green; Min Operating Temperature: -40°C; Max Operating Temperature: 95°C; Illumination Colour: Green; Packaging: Bulk; Package Quantity: 500; Lens Transparency: Clear; Test Current: 20mA; Wavelength: 527nm; Length: 5.8mm; Height: 12.7mm; Width: 5mm; ComponentLink1URL: http://www.mouser.com/ds/2/90/cree.C503B%20BAS%20BAN%20BCS%20BCN%20GAS%20GAN%20GCS%20GCN%201094[1]-310350.pdf; ComponentLink1Description: http://www.mouser.com/ds/2/90/cree.C503B%20BAS%20BAN%20BCS%20BCN%20GAS%20GAN%20GCS%20GCN%201094[1]-310350.pdf; ComponentLink2URL: http://www.cree.com/led-components/media/documents/C503B-BAS-BAN-BCS-BCN-GAS-GAN-GCS-GCN-1094.pdf; ComponentLink2Description: http://www.cree.com/led-components/media/documents/C503B-BAS-BAN-BCS-BCN-GAS-GAN-GCS-GCN-1094.pdf; Design Item ID: LED_C503B-GCS-CB0C0781; Source: diode.SchLib
D3 = CMP-00017-1: BOURNS - SMAJ5.0A - TVS Diode, SMAJ Series, Unidirectional, 5 V, 9.2 V, DO-214AC (SMA), 2 Pins; Min Breakdown Voltage: 6.4V; ESD Protection: Yes; Test Current: 10mA; Clamping Voltage: 9.2V; Leakage Current: 800uA; Max Breakdown Voltage: 7V; Number of Unidirectional Channels: 1; Operating Supply Voltage: 3.5V; Peak Pulse Current: 43.5A; Power Line Protection: No; Peak Pulse Power: 400W; Reverse Standoff Voltage: 5V; Diode Type: ZENER; Element Configuration: Single; Max Surge Current: 40A; Height: 2.42mm; Case/Package: DO-214AC; Max Reverse Leakage Current: 800uA; Packaging: Tape and Reel; REACH SVHC: No SVHC; Direction: Unidirectional; Series: SMAJ; Radiation Hardening: No; Mount: Surface Mount; Max Operating Temperature: 150°C; Package Quantity: 1; Width: 2.92mm; Reverse Breakdown Voltage: 6.4V; Number of Channels: 1; Polarity: Unidirectional; Min Operating Temperature: -55°C; Length: 4.57mm; Resistor Type: Zener; Max Power Dissipation: 400W; Number of Pins: 2; Breakdown Voltage: 7V; Number of Elements: 1; Termination: SMD/SMT
D11 D13 = CMP-033-0052-1: DIODE SWITCH 100V 150MA SOD123; Manufacturer: Micro Commercial Co; Voltage - Forward (Vf) (Max) @ If: 1.25V @ 150mA; Capacitance @ Vr, F: 2pF @ 0V, 1MHz; Diode Type: Standard; Reverse Recovery Time (trr): 4ns; Current - Reverse Leakage @ Vr: 1µA @ 75V; Speed: Small Signal =< 200mA (Io), Any Speed; Voltage - DC Reverse (Vr) (Max): 100V; Stock 1: 145222; Supplier Device Package: SOD-123; Packaging: Cut Tape (CT); Package / Case: SOD-123; Mounting Type: Surface Mount; Design Item ID: DIODE_1N4148WTPMSTR; RoHS: RoHS Compliant; Current - Average Rectified (Io): 150mA; ComponentLink1URL: http://61.222.192.61/mccsemi/up_pdf/1N4148W(SOD123).pdf; Source: diode.SchLib; Pricing 1: 1=0.31, 10=0.202, 25=0.132, 100=0.088, 250=0.0572, 500=0.04048, 1000=0.0286 (USD); ComponentLink1Description: http://61.222.192.61/mccsemi/up_pdf/1N4148W(SOD123).pdf
D12 = CMP-00027-1: DIODE ZENER 68V 500MW SOD123 / Zener Diode Single 68V 5% 230Ohm 500mW 2-Pin SOD-123 T/R; Zener Current: 10mA; Max Reverse Current: 100nA; Breakdown Voltage: 71.4V; Impedance: 230R; Material: Plastic; Forward Voltage: 900mV; Test Current: 1.8mA; Packaging: Tape and Reel; Number of Pins: 2; Tolerance: 5%; Max Power Dissipation: 500mW; Element Configuration: Single; Min Operating Temperature: -55°C; Width: 1.6mm; REACH SVHC: No SVHC; Voltage Rating (DC): 68V; Case/Package: SOD-123-2; Package Quantity: 1; Length: 2.69mm; RoHS Compliant: Yes; Max Operating Temperature: 150°C; Power Rating: 500mW; Working Voltage: 68V; Max Reverse Leakage Current: 100nA; Power Dissipation: 500mW; Lead Free: Lead Free; Voltage Tolerance: 5%; Radiation Hardening: No; Height: 1.12mm
D14 = CMP-033-0060-1: as D1 on sheet Quail; Design Item ID: Diode_CD214A-B1100LF; Part Status: Active; Source: diode.SchLib; Stock 1: 21982; Manufacturer Part Number: CD214A-B1100LF; Diode Type: Schottky; Voltage - DC Reverse (Vr) (Max): 100V; Reverse Recovery Time (trr): -; Operating Temperature - Junction: -55°C ~ 125°C; RoHS: RoHS Compliant; Supplier Device Package: SMA (DO-214AC); Package / Case: DO-214AC, SMA; Packaging: Cut Tape (CT); ComponentLink1Description: http://www.bourns.com/docs/Product-Datasheets/CD214-B120_B1100.pdf; Mounting Type: Surface Mount; Pricing 1: 1=0.54, 10=0.42, 25=0.3544, 100=0.2888, 250=0.2392, 500=0.1976, 1000=0.148, 2500=0.136 (USD); ComponentLink1URL: http://www.bourns.com/docs/Product-Datasheets/CD214-B120_B1100.pdf
FB1 FB3 = CMP-051-0015-1: FERRITE BEAD 120 OHM @ 100 MHz; Manufacturer: Taiyo Yuden; Manufacturer Part Number: BKP1608HS121-T; Filter Type: Power Line; Number of Lines: 1; Current Rating (Max): 2.7A; DC Resistance (DCR) (Max): 35 mOhm; RoHS: RoHS Compliant; Stock 1: 47959; Pricing 1: 1=0.1, 10=0.059, 25=0.052, 50=0.0474, 100=0.0426, 250=0.0312, 500=0.0227, 1000=0.02223 (USD); Packaging: Cut Tape (CT); Part Status: Active; Ratings: -; Operating Temperature: -55°C ~ 85°C; Package / Case: 0603 (1608 Metric); Mounting Type: Surface Mount; Height (Max): 0.037" (0.95mm); Size / Dimension: 0.063" L x 0.031" W (1.60mm x 0.80mm); ComponentLink1URL: http://ds.yuden.co.jp/TYCOMPAS/ut/detail.do?productNo=BKP1608HS121-T&fileName=BKP1608HS121-T_SS&mode=specSheetDownload; ComponentLink1Description: http://ds.yuden.co.jp/TYCOMPAS/ut/detail.do?productNo=BKP1608HS121-T&fileName=BKP1608HS121-T_SS&mode=specSheetDownload; Design Item ID: FB_120@100MHz_0603; Source: inductor.SchLib
FB2 = CMP-051-0015-1: FERRITE BEAD 120 OHM @ 100 MHz; Manufacturer: Taiyo Yuden; Filter Type: Power Line; Number of Lines: 1; Current Rating (Max): 2.7A; DC Resistance (DCR) (Max): 35 mOhm; RoHS: RoHS Compliant; Stock 1: 47959; Pricing 1: 1=0.1, 10=0.059, 25=0.052, 50=0.0474, 100=0.0426, 250=0.0312, 500=0.0227, 1000=0.02223 (USD); Packaging: Cut Tape (CT); Part Status: Active; Ratings: -; Operating Temperature: -55°C ~ 85°C; Package / Case: 0603 (1608 Metric); Mounting Type: Surface Mount; Height (Max): 0.037" (0.95mm); Size / Dimension: 0.063" L x 0.031" W (1.60mm x 0.80mm); ComponentLink1URL: http://ds.yuden.co.jp/TYCOMPAS/ut/detail.do?productNo=BKP1608HS121-T&fileName=BKP1608HS121-T_SS&mode=specSheetDownload; ComponentLink1Description: http://ds.yuden.co.jp/TYCOMPAS/ut/detail.do?productNo=BKP1608HS121-T&fileName=BKP1608HS121-T_SS&mode=specSheetDownload; Design Item ID: FB_120@100MHz_0603; Source: inductor.SchLib
J1 = CMP-00029-2: XT60 Sink, Right Angle; Rule: UNIONINDEX=0|RULEKIND=PolygonConnect|NETSCOPE=AnyNet|LAYERKIND=SameLayer|NAME=Schematic Polygon Connect Style|CONNECTSTYLE=Direct|RELIEFCONDUCTORWIDTH=10mil|RELIEFENTRIES=4|POLYGONRELIEFANGLE=45 Angle|AIRGAPWIDTH=10mil|UNIT=Imperial
Q1 Q3 = CMP-078-0060-2: MOSFET N-CH 20V 60A POWERPAK1212-8; Manufacturer: Vishay Siliconix; Power - Max: 104W; FET Feature: Standard; FET Type: MOSFET N-Channel, Metal Oxide; Vgs(th) (Max) @ Id: 1.5V @ 250µA; Gate Charge (Qg) @ Vgs: 97nC @ 4.5V; Input Capacitance (Ciss) @ Vds: 8130pF @ 10V; Rds On (Max) @ Id, Vgs: 1.6 mOhm @ 20A, 10V; Rule: UNIONINDEX=0|RULEKIND=PolygonConnect|NETSCOPE=AnyNet|LAYERKIND=SameLayer|NAME=Schematic Polygon Connect Style|CONNECTSTYLE=Direct|RELIEFCONDUCTORWIDTH=10mil|RELIEFENTRIES=4|POLYGONRELIEFANGLE=45 Angle|AIRGAPWIDTH=10mil|UNIT=Imperial; Operating Temperature: -55°C ~ 150°C (TJ); Design Item ID: NFET_SIR404DP-T1-GE3CT-ND; Source: transistor_fet.SchLib; ComponentLink1Description: http://www.vishay.com/docs/64815/sir404dp.pdf; ComponentLink1URL: http://www.vishay.com/docs/64815/sir404dp.pdf; RoHS: RoHS Compliant; Pricing 1: 1=1.98, 10=1.775, 100=1.4235, 500=1.17, 1000=0.9685 (USD); Mounting Type: Surface Mount; Package / Case: PowerPAK® SO-8; Packaging: Cut Tape (CT); Manufacturer Part Number: SIR404DP-T1-GE3; Supplier Device Package: PowerPAK® SO-8; Stock 1: 5696
Q4 = CMP-076-0004-1: TRANS NPN 40V 0.2A SMD SOT23-3; Manufacturer: Diodes Incorporated; Frequency - Transition: 300MHz; Current - Collector Cutoff (Max): 50nA (ICBO); Power - Max: 300mW; Current - Collector (Ic) (Max): 200mA; Vce Saturation (Max) @ Ib, Ic: 300mV @ 5mA, 50mA; DC Current Gain (hFE) (Min) @ Ic, Vce: 100 @ 10mA, 1V; Package / Case: TO-236-3, SC-59, SOT-23-3; Packaging: Cut Tape (CT); Mounting Type: Surface Mount; Supplier Device Package: SOT-23-3; Source: transistor_bjt.SchLib; Stock 1: 600097; Pricing 1: 1=0.12, 10=0.108, 100=0.0589, 500=0.03626, 1000=0.02472 (USD); Voltage - Collector Emitter Breakdown (Max): 40V; Transistor Type: NPN; ComponentLink1URL: http://www.diodes.com/_files/datasheets/ds30036.pdf; Part Status: Active; ComponentLink1Description: http://www.diodes.com/_files/datasheets/ds30036.pdf; RoHS: RoHS Compliant; Operating Temperature: -55°C ~ 150°C (TJ); Manufacturer Part Number: MMBT3904-7-F; Design Item ID: NPN_MMBT3904-7-F
R1 = CMP-069-0049-1: Res Current Sense Metal Strip 2512 0.003 Ohm 1% 2W ±25ppm/°C Molded Emboss T/R; Rule: UNIONINDEX=0|RULEKIND=PolygonConnect|NETSCOPE=AnyNet|LAYERKIND=SameLayer|NAME=Schematic Polygon Connect Style|CONNECTSTYLE=Direct|RELIEFCONDUCTORWIDTH=10mil|RELIEFENTRIES=4|POLYGONRELIEFANGLE=45 Angle|AIRGAPWIDTH=10mil|UNIT=Imperial
R2 = CMP-126-0343-2: RES SMD 43K OHM 1% 1/10W 0603; Manufacturer Part Number: RC0603FR-0743KL; Manufacturer: Yageo; Power (Watts): 0.1W, 1/10W; Resistance (Sortable): 43000; Temperature Coefficient: ±100ppm/°C; Tolerance: ±1%; Image: //media.digikey.com/Renders/Yageo%20Renders/0603-(1608-Metric).jpg; Datasheets: http://www.yageo.com/documents/recent/PYu-RC_Group_51_RoHS_L_9.pdf; Operating Temperature: -55°C ~ 155°C
R3 = CMP-126-0172-2: RES SMD 1K OHM 1% 1/10W 0603; Manufacturer: Yageo; Manufacturer Part Number: RC0603FR-071KL; Power (Watts): 0.1W, 1/10W; Resistance (Sortable): 1000; Temperature Coefficient: ±100ppm/°C; Image: //media.digikey.com/Renders/Yageo%20Renders/0603-(1608-Metric).jpg; Operating Temperature: -55°C ~ 155°C; Tolerance: ±1%; Datasheets: http://www.yageo.com/documents/recent/PYu-RC_Group_51_RoHS_L_9.pdf
R4 = CMP-126-0273-2: RES SMD 10K OHM 1% 1/10W 0603; Manufacturer Part Number: RC0603FR-0710KL; Manufacturer: Yageo; Resistance (Sortable): 10000; Power (Watts): 0.1W, 1/10W; Temperature Coefficient: ±100ppm/°C; Datasheets: http://www.yageo.com/documents/recent/PYu-RC_Group_51_RoHS_L_9.pdf; Image: //media.digikey.com/Renders/Yageo%20Renders/0603-(1608-Metric).jpg; Tolerance: ±1%; Operating Temperature: -55°C ~ 155°C
R5 = CMP-126-0304-2: RES SMD 20K OHM 1% 1/10W 0603; Manufacturer Part Number: RC0603FR-0720KL; Manufacturer: Yageo; Resistance (Sortable): 20000; Power (Watts): 0.1W, 1/10W; Temperature Coefficient: ±100ppm/°C; Datasheets: http://www.yageo.com/documents/recent/PYu-RC_Group_51_RoHS_L_9.pdf; Image: //media.digikey.com/Renders/Yageo%20Renders/0603-(1608-Metric).jpg; Tolerance: ±1%; Operating Temperature: -55°C ~ 155°C
R12 R24 = CMP-126-0273-2: RES SMD 10K OHM 1% 1/10W 0603; Manufacturer: Yageo; Manufacturer Part Number: RC0603FR-0710KL; Power (Watts): 0.1W, 1/10W; Resistance (Sortable): 10000; Temperature Coefficient: ±100ppm/°C; Tolerance: ±1%; Datasheets: http://www.yageo.com/documents/recent/PYu-RC_Group_51_RoHS_L_9.pdf; Image: //media.digikey.com/Renders/Yageo%20Renders/0603-(1608-Metric).jpg; Operating Temperature: -55°C ~ 155°C
R13 = CMP-126-0002-2: RES SMD 10 OHM 1% 1/10W 0603; Manufacturer: Yageo; Manufacturer Part Number: RC0603FR-0710RL; Temperature Coefficient: ±200ppm/°C; Resistance (Sortable): 10; Power (Watts): 0.1W, 1/10W; Tolerance: ±1%; Operating Temperature: -55°C ~ 155°C; Image: //media.digikey.com/Renders/Yageo%20Renders/0603-(1608-Metric).jpg; Datasheets: http://www.yageo.com/documents/recent/PYu-RC_Group_51_RoHS_L_9.pdf
R20 R22 = CMP-126-0419-2: RES SMD 240K OHM 1% 1/10W 0603; Manufacturer Part Number: RC0603FR-07240KL; Manufacturer: Yageo; Resistance (Sortable): 240000; Power (Watts): 0.1W, 1/10W; Temperature Coefficient: ±100ppm/°C; Datasheets: http://www.yageo.com/documents/recent/PYu-RC_Group_51_RoHS_L_9.pdf; Tolerance: ±1%; Image: //media.digikey.com/Renders/Yageo%20Renders/0603-(1608-Metric).jpg; Operating Temperature: -55°C ~ 155°C
R21 = CMP-00024-1: Res Thick Film 2512 100 Ohm 5% 1W ±100ppm/°C Molded SMD SMD Embossed T/R; Voltage Rating: 200V; Temperature Coefficient: 200ppm/°C; Rule: UNIONINDEX=0|RULEKIND=PolygonConnect|NETSCOPE=AnyNet|LAYERKIND=SameLayer|NAME=Schematic Polygon Connect Style|CONNECTSTYLE=Direct|RELIEFCONDUCTORWIDTH=10mil|RELIEFENTRIES=4|POLYGONRELIEFANGLE=45 Angle|AIRGAPWIDTH=10mil|UNIT=Imperial; Case Code (Metric): 6432; Resistance Tolerance: 5%; Case/Package: 2512; Power Rating: 1W; Military Standard: Not; REACH SVHC: Unknown; Construction: Rectangular; Length: 6.35mm; Tolerance: 5%; Case Code (Imperial): 2512; RoHS Compliant: Yes; Packaging: Cut Tape; Contact Plating: Tin,Matte; Resistor Type: Thick Film; Radiation Hardening: No; Lead Free: Lead Free; Max Operating Temperature: 155°C; Size Code: 2512; Depth: 3.1mm; Min Operating Temperature: -55°C
R23 = CMP-126-0085-2: RES SMD 150 OHM 1% 1/10W 0603; Manufacturer Part Number: RC0603FR-07150RL; Manufacturer: Yageo; Resistance (Sortable): 150; Power (Watts): 0.1W, 1/10W; Temperature Coefficient: ±100ppm/°C; Operating Temperature: -55°C ~ 155°C; Datasheets: http://www.yageo.com/documents/recent/PYu-RC_Group_51_RoHS_L_9.pdf; Tolerance: ±1%; Image: //media.digikey.com/Renders/Yageo%20Renders/0603-(1608-Metric).jpg
R25 = CMP-126-0382-2: RES SMD 100K OHM 1% 1/10W 0603; Manufacturer: Yageo; Manufacturer Part Number: RC0603FR-07100KL; Power (Watts): 0.1W, 1/10W; Resistance (Sortable): 100000; Temperature Coefficient: ±100ppm/°C; Image: //media.digikey.com/Renders/Yageo%20Renders/0603-(1608-Metric).jpg; Operating Temperature: -55°C ~ 155°C; Tolerance: ±1%; Datasheets: http://www.yageo.com/documents/recent/PYu-RC_Group_51_RoHS_L_9.pdf
SW1 = CMP-00028-1: Switch Slide ON None ON DPDT Side Slide 6A 250VAC 28VDC PC Pins Bracket Mount/Through Hole; Max Voltage Rating (DC): 28V; Insulation Resistance: 1GR; Actuator Color: Black; Max Voltage Rating (AC): 250V; Actuator Length: 4.72mm; Switch Function: On-On; Switch Travel: 2.16mm; Voltage Rating (AC): 120V; Electrical Life: 40000Cycles; Actuator Material: Nylon,Polyamide; Actuator Type: Standard; Rule: UNIONINDEX=0|RULEKIND=PolygonConnect|NETSCOPE=AnyNet|LAYERKIND=SameLayer|NAME=Schematic Polygon Connect Style|CONNECTSTYLE=Direct|RELIEFCONDUCTORWIDTH=10mil|RELIEFENTRIES=4|POLYGONRELIEFANGLE=45 Angle|AIRGAPWIDTH=10mil|UNIT=Imperial; Contact Current Rating: 6A; Voltage Rating (DC): 28V; Contact Plating: Silver; Length: 13.57mm; Min Operating Temperature: -30°C; REACH SVHC: No SVHC; Depth: 22.49mm; Packaging: Bulk; Throw Configuration: DPDT; Termination: PC Pins; Max Current Rating: 6A; Current Rating: 6A; Flammability Rating: UL94 V-0; Series: 1000; Contact Material: Copper,Silver; Radiation Hardening: No; RoHS Compliant: No; Max Operating Temperature: 65°C; Housing Material: Stainless Steel; Orientation: Horizontal; Package Quantity: 1; Lead Free: Lead Free; Mount: Through Hole,Brackets
TP4-TP7 = CMP-055-0004-2: BLACK T/H TEST POINT; Manufacturer Part Number: 5001; Manufacturer: Keystone Electronics; Material - Body: Phosphor Bronze; Material - Insulation: Nylon 46, UL 94V-0; Plating: Silver; ComponentLink1Description: http://www.keyelco.com/product-pdf.cfm?p=1310; Source: mechanical.SchLib; Part Status: Active; Stock 1: 718799; RoHS: RoHS Compliant; Packaging: Bulk; Mounting Type: 0.040" (1.02mm) Hole Diameter; ComponentLink1URL: http://www.keyelco.com/product-pdf.cfm?p=1310; Pricing 1: 1=0.37, 10=0.316, 50=0.2298, 100=0.2209, 250=0.19832, 500=0.18932, 1000=0.1616, 2500=0.14424, 5000=0.13523 (USD); Size / Dimension: 0.100" Dia x 0.180" L (2.54mm x 4.57mm); Color: Black; Design Item ID: TEST_POINT_BLACK_KEYSTONE_5001
U1 = CMP-038-0006-2: Low-Cost, UCSP/SOT23, Micropower, High-Side Current-Sense Amplifier with Voltage; -3db Bandwidth: 200kHz; Bandwidth: 275kHz; Common Mode Rejection Ratio: 85dB; Min Supply Voltage: 2.7V; Power Supply Rejection Ratio (PSRR): 75dB; Number of Elements: 1; Input Bias Current: 2uA; Nominal Supply Current: 30uA; Max Supply Current: 60uA; Voltage Gain: 33.98dB; Max Supply Voltage: 28V; Power Dissipation: 471mW; Input Offset Voltage (Vos): 300uV; Source: ic_analog.SchLib; Design Item ID: AMP_MAX_4372; Radiation Hardening: No; Series: MAX4372F; Number of Pins: 8; Number of Amplifiers: 1; Number of Channels: 1; Operating Supply Current: 30uA; Width: 4mm; Supply Current: 30uA; Height: 1.5mm; Case/Package: SOIC; Length: 5mm; RoHS Compliant: Yes; Package Quantity: 100; Min Operating Temperature: -40°C; Packaging: Rail/Tube; Number of Circuits: 1; REACH SVHC: Unknown; Max Operating Temperature: 85°C; Lead Free: Lead Free
U2 = CMP-048-0040-1: IC VOLTAGE REG 3.3V 800MA SOT223 INDUSTRIAL TEMP; Manufacturer: STMicroelectronics; Regulator Topology: Positive Fixed; Voltage - Dropout (Typical): 1.1V @ 800mA; Number of Regulators: 1; Voltage - Input: Up to 15V; RoHS: RoHS Compliant; Stock 1: 63873; Pricing 1: 1=0.46, 10=0.373, 100=0.2538, 500=0.19034, 1000=0.14276 (USD); Packaging: Cut Tape (CT); Part Status: Active; Voltage - Output: 3.3V; Current - Output: 800mA; Current - Limit (Min): -; Operating Temperature: -40°C ~ 125°C; Mounting Type: Surface Mount; Package / Case: TO-261-4, TO-261AA; Supplier Device Package: SOT-223; ComponentLink1URL: http://www.st.com/content/ccc/resource/technical/document/datasheet/99/3b/7d/91/91/51/4b/be/CD00000544.pdf/files/CD00000544.pdf/jcr:content/translations/en.CD00000544.pdf; ComponentLink1Description: http://www.st.com/content/ccc/resource/technical/document/datasheet/99/3b/7d/91/91/51/4b/be/CD00000544.pdf/files/CD00000544.pdf/jcr:content/translations/en.CD00000544.pdf; Design Item ID: LDO_LD1117S33CTR; Source: ic_pmic.SchLib
U3 = CMP-048-0060-1: IC REG LDO 5V 1A DPAK; Manufacturer: ON Semiconductor; Regulator Topology: Positive Fixed; Voltage - Dropout (Typical): 1.07V @ 800mA; Number of Regulators: 1; Voltage - Input: Up to 20V; RoHS: RoHS Compliant; Stock 1: 1849; Pricing 1: 1=0.46, 10=0.391, 100=0.2919, 500=0.22932, 1000=0.17721 (USD); Packaging: Cut Tape (CT); Part Status: Active; Current - Limit (Min): 1A; Operating Temperature: 0°C ~ 125°C; Mounting Type: Surface Mount; Package / Case: TO-252-3, DPak (2 Leads + Tab), SC-63; Supplier Device Package: DPAK-3; ComponentLink1URL: http://www.onsemi.com/pub_link/Collateral/NCP1117-D.PDF; ComponentLink1Description: http://www.onsemi.com/pub_link/Collateral/NCP1117-D.PDF; Source: ic_pmic.SchLib; Design Item ID: LDO_NCP1117DT50RKG
U4 = CMP-00023-2: Hot-swap Controller, 72V, DFN-10; Min Supply Voltage: 4V; Number of Circuits: 1; Clamping Voltage: 13.5V; Min Operating Temperature: 0°C; RoHS Compliant: Yes; Max Supply Voltage: 72V; Case/Package: DFN; Number of Pins: 10; Packaging: Rail/Tube; Max Operating Temperature: 70°C; Working Voltage: 72V; REACH SVHC: No SVHC

## Sheet MC33797.SchDoc: Squibs
size Legal; Project: Olympus; Organization: Stanford SSI; Address1: L3, 12a Rodborough Rd; Address2: Frenchs Forest; Address3: NSW; Address4: Australia 2086; SheetNumber: n; SheetTotal: m
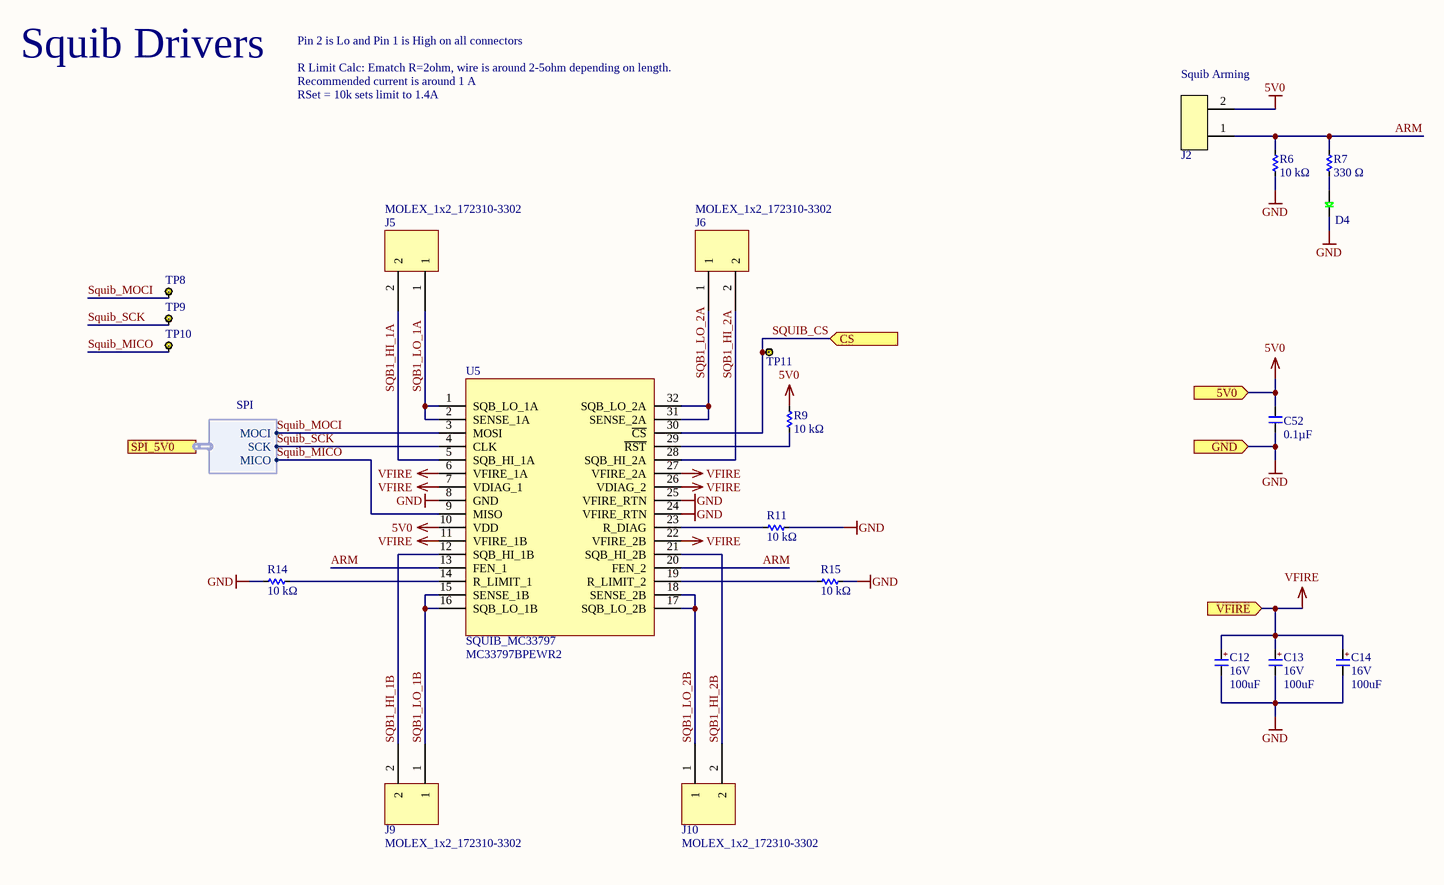
[diagram p2: MC33797.SchDoc]

### Parts
C12  Capacitance: 100uF  Voltage Rating: 16V  [CAPCP6032X28N]  (hidden comment: TPSC107M016R0200)
C13  Capacitance: 100uF  Voltage Rating: 16V  [CAPCP6032X28N]  (hidden comment: TPSC107M016R0200)
C14  Capacitance: 100uF  Voltage Rating: 16V  [CAPCP6032X28N]  (hidden comment: TPSC107M016R0200)
C52  Capacitance (shorthand): 0.1µF  [C0603]  (hidden comment: 490-1519-1-ND)
D4  LED_C503B-GCS-CB0C0781  [LED_TH_5MM]  (value not drawn)
J2  CONN_1x2  [CONN_1x2_100MIL]  (value not drawn)
J5  MOLEX_1x2_172310-3302  [Molex 172310-xx02]
J6  MOLEX_1x2_172310-3302  [Molex 172310-xx02]
J9  MOLEX_1x2_172310-3302  [Molex 172310-xx02]
J10  MOLEX_1x2_172310-3302  [Molex 172310-xx02]
R6  Resistance: 10 kΩ  [R0603]  (hidden comment: 311-10.0KHRCT-ND)
R7  Resistance: 330 Ω  [R0603]  (hidden comment: 311-330HRCT-ND)
R9  Resistance: 10 kΩ  [R0603]  (hidden comment: 311-10.0KHRCT-ND)
R11  Resistance: 10 kΩ  [R0603]  (hidden comment: 311-10.0KHRCT-ND)
R14  Resistance: 10 kΩ  [R0603]  (hidden comment: 311-10.0KHRCT-ND)
R15  Resistance: 10 kΩ  [R0603]  (hidden comment: 311-10.0KHRCT-ND)
TP8  TEST_POINT_BLACK_KEYSTONE_5001  [TEST_POINT_BLACK_KEYSTONE_5001-Footprint-1]  (value not drawn)
TP9  TEST_POINT_BLACK_KEYSTONE_5001  [TEST_POINT_BLACK_KEYSTONE_5001-Footprint-1]  (value not drawn)
TP10  TEST_POINT_BLACK_KEYSTONE_5001  [TEST_POINT_BLACK_KEYSTONE_5001-Footprint-1]  (value not drawn)
TP11  TEST_POINT_BLACK_KEYSTONE_5001  [TEST_POINT_BLACK_KEYSTONE_5001-Footprint-1]  (value not drawn)
U5  SQUIB_MC33797  Manufacturer Part Number: MC33797BPEWR2  [SOT1762-1]

### Ports
5V0 (in), CS (in), GND (in), SPI_5V0 (harness SPI), VFIRE (in)

### Harnesses
SPI: SCK, MOCI, MICO

### Nets
5V0: C52.1 J2.2 R9.2 U5.10(VDD) ; port 5V0
GND: C12.2(K) C13.2(K) C14.2(K) C52.2 D4.2(K) R6.2 R11.2 R14.1 R15.2 U5.8(GND) U5.24(VFIRE_RTN) U5.25(VFIRE_RTN) ; port GND  [project net DGND]
VFIRE: C12.1(A) C13.1(A) C14.1(A) U5.6(VFIRE_1A) U5.7(VDIAG_1) U5.11(VFIRE_1B) U5.22(VFIRE_2B) U5.26(VDIAG_2) U5.27(VFIRE_2A) ; port VFIRE  [project net 12V0_SW]
ARM: J2.1 R6.1 R7.2 U5.13(FEN_1) U5.20(FEN_2)
SQB1_HI_1A: J5.2 U5.5(SQB_HI_1A)
SQB1_HI_1B: J9.2 U5.12(SQB_HI_1B)
SQB1_HI_2A: J6.2 U5.28(SQB_HI_2A)
SQB1_HI_2B: J10.2 U5.21(SQB_HI_2B)
SQB1_LO_1A: J5.1 U5.1(SQB_LO_1A) U5.2(SENSE_1A)
SQB1_LO_1B: J9.1 U5.15(SENSE_1B) U5.16(SQB_LO_1B)
SQB1_LO_2A: J6.1 U5.31(SENSE_2A) U5.32(SQB_LO_2A)
SQB1_LO_2B: J10.1 U5.17(SQB_LO_2B) U5.18(SENSE_2B)
SQUIB_CS: TP11.1 U5.30(~{CS}) ; port CS
Squib_MICO: TP10.1 U5.9(MISO) ; port SPI_5V0.MICO
Squib_MOCI: TP8.1 U5.3(MOSI) ; port SPI_5V0.MOCI
Squib_SCK: TP9.1 U5.4(CLK) ; port SPI_5V0.SCK
NetD4_1: D4.1(A) R7.1
NetR9_1: R9.1 U5.29(~{RST})
NetR11_1: R11.1 U5.23(R_DIAG)
NetR14_2: R14.2 U5.14(R_LIMIT_1)
NetR15_1: R15.1 U5.19(R_LIMIT_2)

### Notes on the sheet
- Squib Drivers
- R Limit Calc: Ematch R=2ohm, wire is around 2-5ohm depending on length.
- Pin 2 is Lo and Pin 1 is High on all connectors
- Recommended current is around 1 A
- (near J2) Squib Arming
- RSet = 10k sets limit to 1.4A
- PROJECT
- SHEET
- Powered By
- Sheet
- of
- REVISION
- ssi.stanford.edu
- ENGINEER
- REVIEWER
- REVIEWED ON
- (in symbol CMP-066-0014-2) +

### Library data of the parts
C12-C14 = CMP-066-0014-2: Cap Tant Solid 100uF 16V C CASE 20% (6 X 3.2 X 2.6mm) SMD 6032-28 0.2 Ohm 125°C T/R; ESR (Equivalent Series Resistance): 200mR; Polarity: Polar; Dissipation Factor: 6%; Construction: Flat; Tolerance: 20%; Lead Free: Lead Free; Termination: SMD/SMT; Min Operating Temperature: -55°C; Depth: 3.2mm; Case Code (Imperial): 2312; Mount: Surface Mount; Length: 6mm; Series: TPS; Package Quantity: 500; Max Operating Temperature: 125°C; Packaging: Tape and Reel; Radiation Hardening: No; Height: 2.8mm; Height - Seated (Max): 0.11inch; Voltage Rating (DC): 16V; Case/Package: Molded; Features: General Purpose; Width: 3.2mm; Case Code (Metric): 6032; RoHS Compliant: Yes
C52 = CMP-119-0065-1: as C7 on sheet BatteryRegulators; Rated Voltage: 50V; Dielectric: X7R
D4 = CMP-033-0070-3: as D2 on sheet BatteryRegulators; Manufacturer Part Number: C503B-GCS-CB0C0781; Stock 1: 191; Pricing 1: 1=0.25, 10=0.236, 100=0.2184, 1000=0.1954, 50000=0.1814 (USD); Mount: Through Hole; Case/Package: Radial; Colour: Green; Min Operating Temperature: -40°C; Max Operating Temperature: 95°C; Illumination Colour: Green; Packaging: Bulk; Package Quantity: 500; Lens Transparency: Clear; Test Current: 20mA; Wavelength: 527nm; Length: 5.8mm; Height: 12.7mm; Width: 5mm; ComponentLink1URL: http://www.mouser.com/ds/2/90/cree.C503B%20BAS%20BAN%20BCS%20BCN%20GAS%20GAN%20GCS%20GCN%201094[1]-310350.pdf; ComponentLink1Description: http://www.mouser.com/ds/2/90/cree.C503B%20BAS%20BAN%20BCS%20BCN%20GAS%20GAN%20GCS%20GCN%201094[1]-310350.pdf; ComponentLink2URL: http://www.cree.com/led-components/media/documents/C503B-BAS-BAN-BCS-BCN-GAS-GAN-GCS-GCN-1094.pdf; ComponentLink2Description: http://www.cree.com/led-components/media/documents/C503B-BAS-BAN-BCS-BCN-GAS-GAN-GCS-GCN-1094.pdf; Design Item ID: LED_C503B-GCS-CB0C0781; Source: diode.SchLib
J2 = CMP-029-0001-1: CONN HEADER 2POS VERT T/H; Manufacturer Part Number: 77311-118-02LF; Manufacturer: FCI; Number of Positions: 2; Pitch: 0.100" (2.54mm); Connector Type: Header, Unshrouded; Number of Positions Loaded: All; Features: -; ComponentLink1URL: http://portal.fciconnect.com/res/en/pdffiles/doc_search//77311.pdf; Row Spacing: -; Mounting Type: Through Hole; Contact Finish: Gold, GXT™; RoHS: RoHS Compliant; Termination: Solder; Source: connector.SchLib; Number of Rows: 1; Color: Black; ComponentLink1Description: http://portal.fciconnect.com/res/en/pdffiles/doc_search//77311.pdf; Contact Mating Length: 0.230" (5.84mm); Packaging: Bulk; Design Item ID: CONN_1x2; Fastening Type: -; Contact Type: Male Pin; Contact Finish Thickness: 30µin (0.76µm)
J5 J6 J9 J10 = CMP-025-0004-1: ULTRAFIT CONN HEADER R/A 2POS 3.5MM; Source: connector.SchLib; Design Item ID: MOLEX_1x2_1723101102
R6 R9 R11 R14 R15 = CMP-126-0273-2: as R4 on sheet BatteryRegulators; Datasheets: http://www.yageo.com/documents/recent/PYu-RC_Group_51_RoHS_L_9.pdf; Image: //media.digikey.com/Renders/Yageo%20Renders/0603-(1608-Metric).jpg; Tolerance: ±1%; Operating Temperature: -55°C ~ 155°C
R7 = CMP-126-0120-2: RES SMD 330 OHM 1% 1/10W 0603; Manufacturer Part Number: RC0603FR-07330RL; Manufacturer: Yageo; Resistance (Sortable): 330; Power (Watts): 0.1W, 1/10W; Temperature Coefficient: ±100ppm/°C; Datasheets: http://www.yageo.com/documents/recent/PYu-RC_Group_51_RoHS_L_9.pdf; Image: //media.digikey.com/Renders/Yageo%20Renders/0603-(1608-Metric).jpg; Tolerance: ±1%; Operating Temperature: -55°C ~ 155°C
TP8-TP11 = CMP-055-0004-2: as TP4 on sheet BatteryRegulators; ComponentLink1Description: http://www.keyelco.com/product-pdf.cfm?p=1310; Source: mechanical.SchLib; Part Status: Active; Stock 1: 718799; RoHS: RoHS Compliant; Packaging: Bulk; Mounting Type: 0.040" (1.02mm) Hole Diameter; ComponentLink1URL: http://www.keyelco.com/product-pdf.cfm?p=1310; Pricing 1: 1=0.37, 10=0.316, 50=0.2298, 100=0.2209, 250=0.19832, 500=0.18932, 1000=0.1616, 2500=0.14424, 5000=0.13523 (USD); Size / Dimension: 0.100" Dia x 0.180" L (2.54mm x 4.57mm); Color: Black; Design Item ID: TEST_POINT_BLACK_KEYSTONE_5001
U5 = CMP-045-0005-1: Manufacturer: NXP USA Inc.; Interface: SPI; Voltage - Supply: 4.75 V ~ 5.25 V; RoHS: RoHS Compliant; Packaging: Cut Tape (CT); Part Status: Active; Applications: -; Package / Case: 32-SOIC (0.295", 7.50mm Width); Supplier Device Package: 32-SOIC; Mounting Type: Surface Mount; ComponentLink1URL: http://cache.freescale.com/files/analog/doc/data_sheet/MC33797.pdf; ComponentLink1Description: http://cache.freescale.com/files/analog/doc/data_sheet/MC33797.pdf; Source: ic_interface.SchLib; Design Item ID: SQUIB_MC33797